# EAGLE design Mixer-Analog-OPA2134-Rev-G (EAGLE 8.3.1)
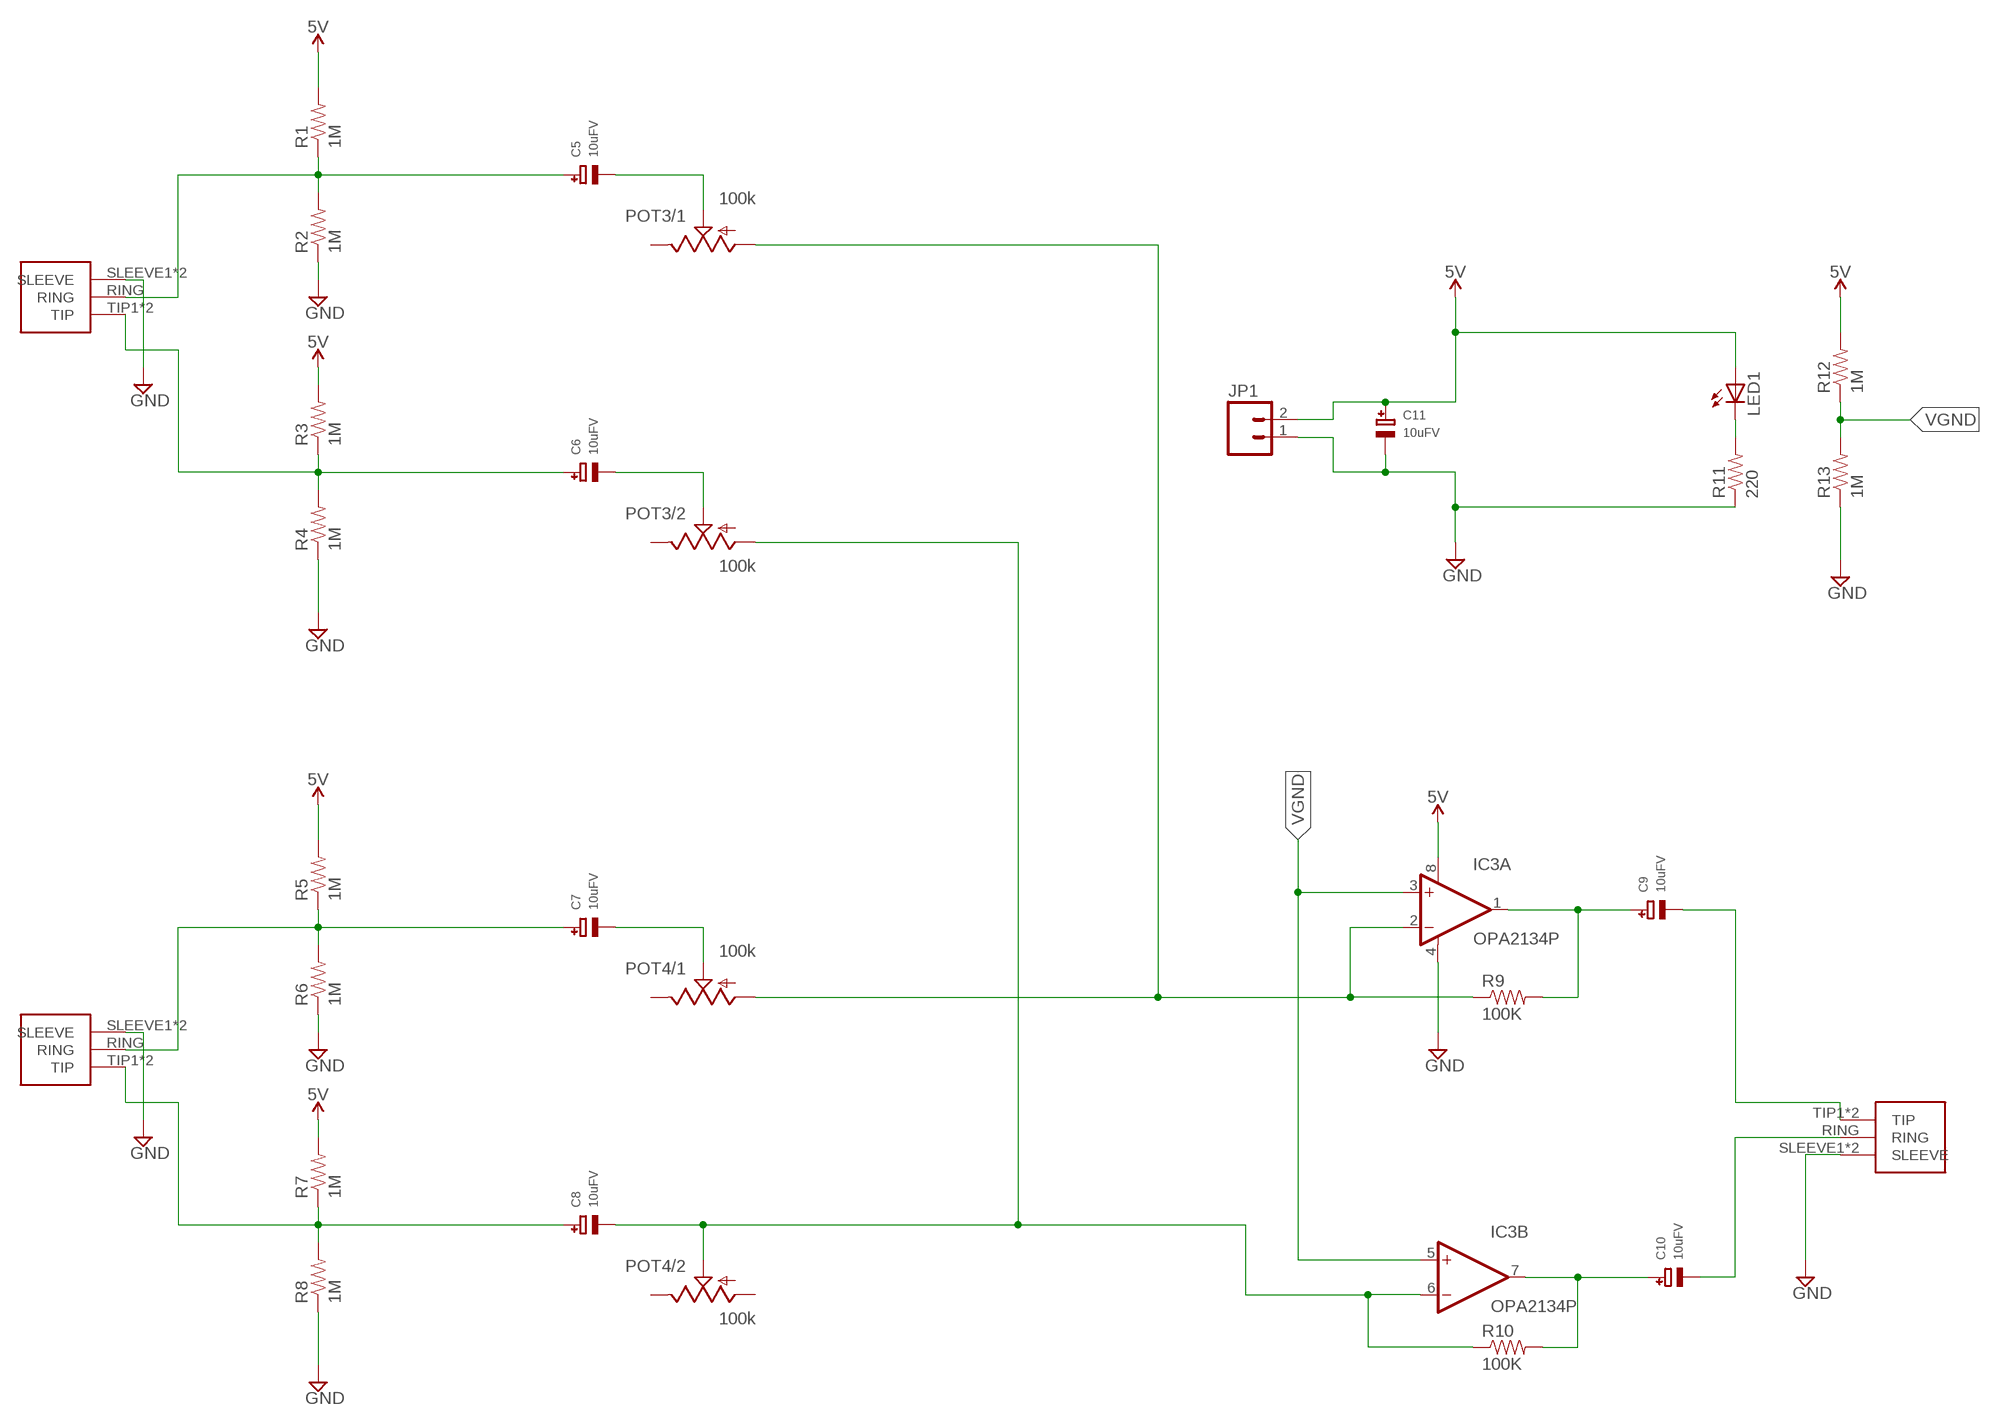
[diagram p0: schematic, sheet 1]

## Parts
C5  10uFV  CAP_ELECTROLYTICPTH_3.5MMGRID_8MMDIA  [CELEC_3.5MM_8MM]
C6  10uFV  CAP_ELECTROLYTICPTH_3.5MMGRID_8MMDIA  [CELEC_3.5MM_8MM]
C7  10uFV  CAP_ELECTROLYTICPTH_3.5MMGRID_8MMDIA  [CELEC_3.5MM_8MM]
C8  10uFV  CAP_ELECTROLYTICPTH_3.5MMGRID_8MMDIA  [CELEC_3.5MM_8MM]
C9  10uFV  CAP_ELECTROLYTICPTH_3.5MMGRID_8MMDIA  [CELEC_3.5MM_8MM]
C10  10uFV  CAP_ELECTROLYTICPTH_3.5MMGRID_8MMDIA  [CELEC_3.5MM_8MM]
C11  10uFV  CAP_ELECTROLYTICPTH_3.5MMGRID_8MMDIA  [CELEC_3.5MM_8MM]
IC3  OPA2134P  [DIL08]
J1  1/8"-F-STEREO-PCB  [1/8"-F-STEREO-PCB]
J2  1/8"-F-STEREO-PCB  [1/8"-F-STEREO-PCB]
J3  1/8"-F-STEREO-PCB  [1/8"-F-STEREO-PCB]
JP1  M02LOCK  [1X02_LOCK]
LED1  LED3MM  [LED3MM]
POT3  100k  POT-DUAL-PTV112-4420  [PTV112]
POT4  100k  POT-DUAL-PTV112-4420  [PTV112]
R1  1M  RESISTOREZ  [AXIAL-0.3EZ]
R2  1M  RESISTORAXIAL-0.3  [AXIAL-0.3]
R3  1M  RESISTOREZ  [AXIAL-0.3EZ]
R4  1M  RESISTOREZ  [AXIAL-0.3EZ]
R5  1M  RESISTOREZ  [AXIAL-0.3EZ]
R6  1M  RESISTOREZ  [AXIAL-0.3EZ]
R7  1M  RESISTOREZ  [AXIAL-0.3EZ]
R8  1M  RESISTOREZ  [AXIAL-0.3EZ]
R9  100K  RESISTOREZ  [AXIAL-0.3EZ]
R10  100K  RESISTOREZ  [AXIAL-0.3EZ]
R11  220  RESISTOREZ  [AXIAL-0.3EZ]
R12  1M  RESISTOREZ  [AXIAL-0.3EZ]
R13  1M  RESISTOREZ  [AXIAL-0.3EZ]

## Nets
5V: C11.+ IC3.8(A:V+) JP1.2 LED1.A R1.P$2 R3.P$2 R5.P$2 R7.P$2 R12.P$2
GND: C11.- IC3.4(A:V-) J1.SLEEVE1(SLEEVE) J1.SLEEVE2(SLEEVE) J2.SLEEVE1(SLEEVE) J2.SLEEVE2(SLEEVE) J3.SLEEVE1(SLEEVE) J3.SLEEVE2(SLEEVE) JP1.1 R2.P$1 R4.P$1 R6.P$1 R8.P$1 R11.P$1 R13.P$1
N$2: C5.- POT3.1.2(/1:S)
N$3: C6.+ J1.TIP1(TIP) J1.TIP2(TIP) R3.P$1 R4.P$2
N$5: C5.+ J1.RING R1.P$1 R2.P$2
N$6: C6.- POT3.2.2(/2:S)
N$7: C9.+ IC3.1(A:OUT) R9.P$2
N$10: C7.- POT4.1.2(/1:S)
N$13: C7.+ J2.RING R5.P$1 R6.P$2
N$14: C8.+ J2.TIP1(TIP) J2.TIP2(TIP) R7.P$1 R8.P$2
N$15: LED1.K(C) R11.P$2
N$17: C10.+ IC3.7(B:OUT) R10.P$2
N$61: C9.- J3.TIP1(TIP) J3.TIP2(TIP)
N$62: C10.- J3.RING
OUT-L: IC3.2(A:-IN) POT3.1.1(/1:A) POT4.1.1(/1:A) R9.P$1
OUT-R: C8.- IC3.6(B:-IN) POT3.2.1(/2:A) POT4.2.2(/2:S) R10.P$1
VGND: IC3.3(A:+IN) IC3.5(B:+IN) R12.P$1 R13.P$2
Unconnected: POT3.1.3(/1:E) POT3.2.3(/2:E) POT4.1.3(/1:E) POT4.2.1(/2:A) POT4.2.3(/2:E)

## Library data of the parts
C5-C11 = microbuilder:CAP_ELECTROLYTIC: Electrolytic Capacitors SMT PANASONIC_C - Size C Panasonic Electrolytic Aluminum Capacitor 47µF 16V 20% Electrolytic Capacitor [Digikey: PCE3890TR-ND] PANASONIC_D - Size D Panasonic Electrolytic Aluminum Capacitor 100µF 25V 20% Electrolytic Capacitor [Digikey: PCE3898TR-ND] PTH 3.5 mm grid, 8 mm diameter ... 3.5 mm grid, 10 mm diameter ...
IC3 = burr-brown:OPA2134: Operational Amplifier; MF: TEXAS INSTRUMENTS; MPN: OPA2134PA; OC_FARNELL: 1097574; OC_NEWARK: 74K3897
J1-J3 = CMU-ArtFab:1/8"-F-STEREO-PCB
JP1 = CMU-ArtFab:M02: Header 2 Standard 2-pin 0.1" header. Use with straight break away headers (SKU : PRT-00116), right angle break away headers (PRT-00553), swiss pins (PRT-00743), machine pins (PRT-00117), and female headers (PRT-00115). Molex polarized connector foot print use with SKU : PRT-08233 with associated crimp pins and housings.
LED1 = led:LED: LED OSRAM: - CHIPLED LG R971, LG N971, LY N971, LG Q971, LY Q971, LO R971, LY R971 LH N974, LH R974 LS Q976, LO Q976, LY Q976 LO Q996 - Hyper CHIPLED LW Q18S LB Q993, LB Q99A, LB R99A - SideLED LS A670, LO A670, LY A670, LG A670, LP A670 LB A673, LV A673, LT A673, LW A673 LH A674 LY A675 LS A676, LA A676, LO A676, LY A676, LW A676 LS A679, LY A679, LG A679 - Hyper Micro SIDELED® LS Y876, LA Y876, LO Y876, LY Y876 LT Y87S - SmartLED LW L88C, LW L88S LB L89C, LB L89S, LG L890 LS L89K, LO L89K, LY L89K LS L896, LA L896, LO L896, LY L896 - TOPLED LS T670, LO T670, LY T670, LG T670, LP T670 LSG T670, LSP T670, LSY T670, LOP T670, LYG T670 LG T671, LOG T671, LSG T671 LB T673, LV T673, LT T673, LW T673 LH T674 LS T676, LA T676, LO T676, LY T676, LB T676, LH T676, LSB T676, LW T676 LB T67C, LV T67C, LT T67C, LS T67K, LO T67K, LY T67K, LW E67C LS E67B, LA E67B, LO E67B, LY E67B, LB E67C, LV E67C, LT E67C LW T67C LS T679, LY T679, LG T679 LS T770, LO T770, LY T770, LG T770, LP T770 LB T773, LV T773, LT T773, LW T773 LH T774 LS E675, LA E675, LY E675, LS T675 LS T776, LA T776, LO T776, LY T776, LB T776 LHGB T686 LT T68C, LB T68C - Hyper Mini TOPLED® LB M676 - Mini TOPLED Santana® LG M470 LS M47K, LO M47K, LY M47K Source: http://www.osram.convergy.de LUXEON: - LUMILED® LXK2-PW12-R00, LXK2-PW12-S00, LXK2-PW14-U00, LXK2-PW14-V00 LXK2-PM12-R00, LXK2-PM12-S00, LXK2-PM14-U00 LXK2-PE12-Q00, LXK2-PE12-R00, LXK2-PE12-S00, LXK2-PE14-T00, LXK2-PE14-U00 LXK2-PB12-K00, LXK2-PB12-L00, LXK2-PB12-M00, LXK2-PB14-N00, LXK2-PB14-P00, LXK2-PB14-Q00 LXK2-PR12-L00, LXK2-PR12-M00, LXK2-PR14-Q00, LXK2-PR14-R00 LXK2-PD12-Q00, LXK2-PD12-R00, LXK2-PD12-S00 LXK2-PH12-R00, LXK2-PH12-S00 LXK2-PL12-P00, LXK2-PL12-Q00, LXK2-PL12-R00 Source: www.luxeon.com KINGBRIGHT: KA-3528ASYC Source: www.kingbright.com
POT3 POT4 = CMU-ArtFab:POT-DUAL-PTV112: Bourns 11mm dual potentiometer; AVAILABILITY: Unavailable; DESCRIPTION: Alt# Tce-10111410; MF: STMicroelectronics; MP: PTV112; PACKAGE: None; PRICE: None; SPICEPREFIX: J
R1-R10 = SparkFun-Passives:RESISTOR: Resistor Basic schematic elements and footprints for 0603, 1206, and PTH resistors.; SPICEPREFIX: R
R11-R13 = SparkFun-Passives:RESISTOR: Resistor Basic schematic elements and footprints for 0603, 1206, and PTH resistors.

## Board
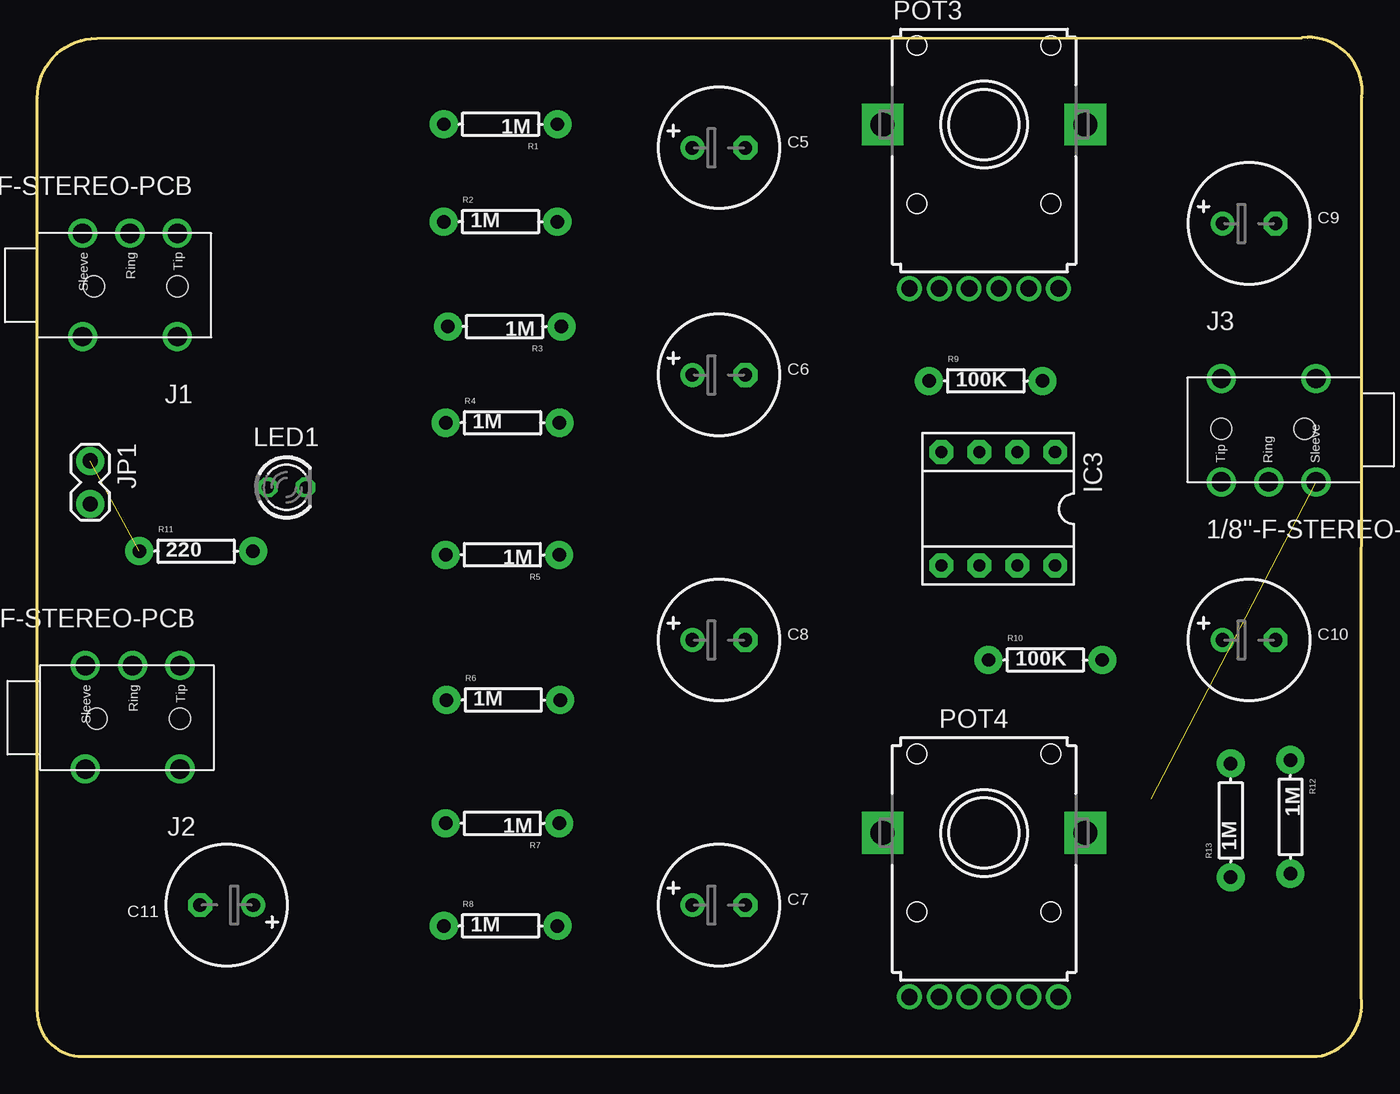
[diagram p1: board, top side]
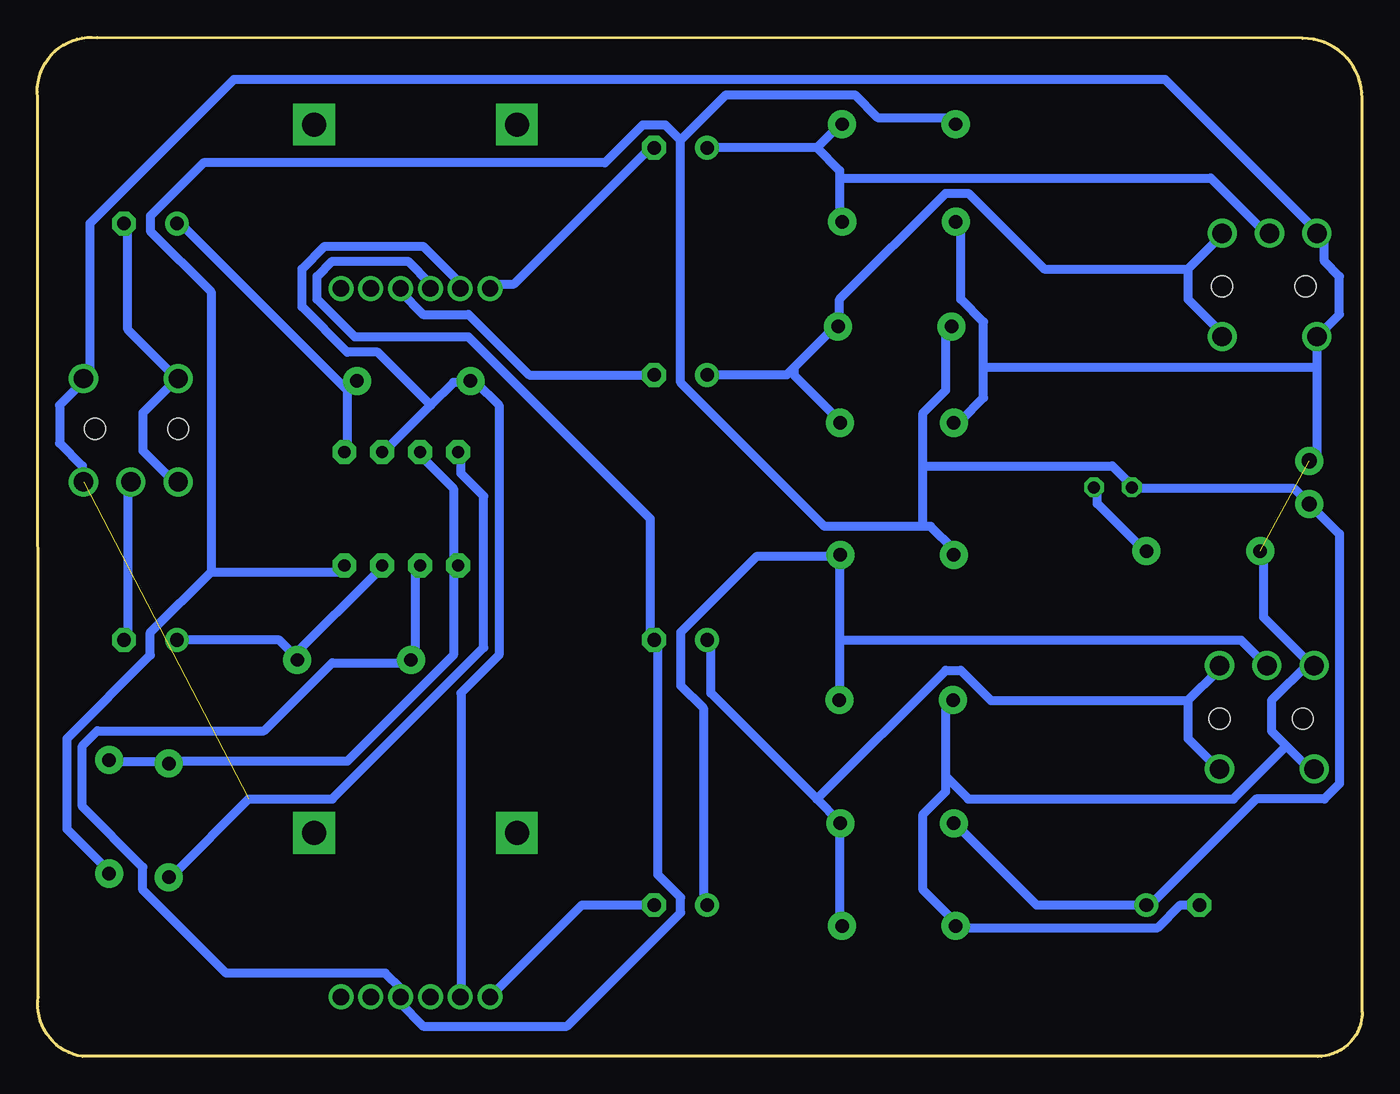
[diagram p2: board, bottom side, seen from below]

Size 88.87 x 68.37 mm. Coordinates in mm from the lower left corner, seen from the top.
Outline: 0,3 arc90 3,0 85.84,0 arc90 88.8,4 88.85,64.35 arc103 84.85,68.35 4,68.3 arc90 0,64.3 0,3
Copper layers (1*16): Top 0.035mm / dielectric 1.5mm / Bottom 0.035mm
Design rules "default *": minimum track width 24mil, minimum drill 0.35mm, track to track 16mil, track to pad 16mil, pad to pad 16mil, via to via 16mil, smd to smd 16mil, copper to edge 40mil, drill to drill 6mil, minimum pad ring 10mil, minimum via ring 8mil, stop-mask expansion 4mil, vias tented up to drill 0mil, thermal gap 10mil

### Footprints (pad centres in the part's own frame; a part is rotated, then mirrored left to right if it is on the bottom)
CELEC_3.5MM_8MM = drill 0.914 pad 1.6: + -1.778,0 | drill 0.914 pad 1.6 octagon: - 1.778,0
DIL08 = drill 0.813 pad 1.6 octagon: 1 -3.81,-3.81; 2 -1.27,-3.81; 3 1.27,-3.81; 4 3.81,-3.81; 5 3.81,3.81; 6 1.27,3.81; 7 -1.27,3.81; 8 -3.81,3.81
1/8"-F-STEREO-PCB = drill 1.3: RING 5.461,0; SLEEVE1 8.636,6.934; SLEEVE2 8.636,0; TIP1 2.286,6.934; TIP2 2.286,0 | hole 1.4: 2.286,3.556; 7.874,3.556
1X02_LOCK = drill 1.016 pad 1.88: 1 -0.178,0; 2 2.718,0
LED3MM = drill 0.813 octagon: A -1.27,0; K 1.27,0
PTV112 = drill 1.1 pad 1.676: 1.1 -3,-11; 1.2 -5,-11; 1.3 5,-11; 2.1 -1,-11; 2.2 1,-11; 2.3 3,-11 | drill 1.6 pad 2.8 square: M1 -6.8,0; M2 6.8,0
AXIAL-0.3EZ = drill 0.9 pad 1.88: P$1 -3.81,0; P$2 3.81,0
AXIAL-0.3 = drill 0.9 pad 1.88: P$1 -3.81,0; P$2 3.81,0

### Placement (x,y rotation side)
C5  45.72,60.96 0 top
C6  45.72,45.72 0 top
C7  45.72,10.16 0 top
C8  45.72,27.94 0 top
C9  81.28,55.88 0 top
C10  81.28,27.94 0 top
C11  12.7,10.16 180 top
IC3  64.46,36.74 180 top
J1  11.68,55.23 180 top
J2  11.86,26.22 180 top
J3  77.14,38.54 0 top
JP1  3.55,39.78 270 top
LED1  16.72,38.18 0 top
POT3  63.5,62.52 0 top
POT4  63.5,15 0 top
R1  31.08,62.54 180 top
R2  31.07,56 0 top
R3  31.35,48.97 180 top
R4  31.21,42.51 0 top
R5  31.2,33.65 180 top
R6  31.26,23.92 0 top
R7  31.2,15.65 180 top
R8  31.08,8.76 0 top
R9  63.62,45.32 0 top
R10  67.62,26.6 0 top
R11  10.66,33.9 0 top
R12  84.06,16.08 270 top
R13  80.05,15.84 90 top

### Tracks (layer width: path | path; a pad name or v marks a point on that pad's centre or on a via)
5V
  Bottom 0.61: 77.22,32.51 68.58,32.51 IC3.8 | 77.22,32.51 81.28,28.45 81.28,26.92 86.87,21.34 86.87,15.24 84.33,12.7 R12.P$2 | R7.P$2 26.92,15.24 21.84,10.16 C11.+ 14.22,10.16 7.11,17.27 2.54,17.27 1.52,18.29 1.52,35.05 3.05,36.58 JP1.2 3.56,37.08 4.57,38.1 15.24,38.1 LED1.A 15.75,38.61 16.76,39.62 29.46,39.62 | 45.72,61.47 42.67,64.52 34.04,64.52 32.51,62.99 27.43,62.99 R1.P$2 | 45.72,61.47 45.72,45.21 36.07,35.56 29.46,35.56 | 29.46,35.56 28.96,35.56 27.43,34.04 R5.P$2 | 29.46,35.56 29.46,39.62 | 29.46,39.62 29.46,43.18 27.94,44.7 27.94,48.77 R3.P$2 | 77.22,32.51 77.22,51.31 81.28,55.37 81.28,56.39 77.72,59.94 50.8,59.94 48.26,62.48 46.74,62.48 45.72,61.47
GND  (2 unrouted)
  Bottom 0.61: 3.56,26.42 6.6,29.46 6.6,33.53 R11.P$1 | 5.08,20.83 6.1,21.84 6.1,23.88 3.56,26.42 | 5.08,20.83 3.56,19.3 J2.SLEEVE1 | 3.56,26.42 J2.SLEEVE2 | C11.- 12.19,10.16 13.72,8.64 26.92,8.64 R8.P$1 27.43,9.14 29.46,11.18 29.46,16.26 27.94,17.78 27.94,18.8 | 27.94,18.8 27.94,23.88 R6.P$1 | 5.08,20.83 8.64,17.27 26.42,17.27 27.94,18.8 | 25.4,46.23 25.4,44.2 26.92,42.67 R4.P$1 | 25.4,46.23 25.4,49.28 26.92,50.8 26.92,55.88 R2.P$1 | J3.SLEEVE2 85.85,38.61 85.85,39.62 87.38,41.15 87.38,43.69 85.85,45.21 J3.SLEEVE1 85.34,45.72 85.34,55.88 75.69,65.53 13.21,65.53 3.05,55.37 J1.SLEEVE2 2.54,54.86 2.54,53.34 1.52,52.32 1.52,49.78 2.54,48.77 J1.SLEEVE1 3.05,48.26 3.05,46.23 | 3.05,46.23 3.05,40.13 JP1.1 | 3.05,46.23 25.4,46.23 | IC3.4 60.45,40.13 60.45,39.12 58.93,37.59 58.93,27.43 69.09,17.27 74.68,17.27 79.76,12.19 R13.P$1
N$2
  Bottom 0.61: C5.- 47.75,60.96 56.9,51.82 58.42,51.82 POT3.1.2
N$3
  Bottom 0.61: 11.68,52.83 11.68,50.8 9.65,48.77 J1.TIP1 | 11.68,52.83 9.65,54.86 J1.TIP2 | C6.+ 38.61,45.72 38.1,46.23 | 38.1,46.23 35.56,48.77 R3.P$1 35.05,49.28 35.05,50.8 27.94,57.91 26.42,57.91 21.34,52.83 11.68,52.83 | 38.1,46.23 38.1,45.72 35.05,42.67 R4.P$2
N$5
  Bottom 0.61: 36.58,60.96 C5.+ | 36.58,60.96 35.05,62.48 R1.P$1 | 35.05,58.93 35.05,59.44 36.58,60.96 | 35.05,58.93 35.05,56.39 R2.P$2 | 35.05,58.93 10.16,58.93 6.6,55.37 J1.RING
N$6
  Bottom 0.61: C6.- 55.88,45.72 59.94,49.78 62.99,49.78 64.52,51.31 POT3.2.2
N$7
  Bottom 0.61: 68.07,44.7 68.07,40.64 IC3.1 | 68.07,44.7 67.56,45.21 R9.P$2 68.07,44.7 | 68.07,44.7 79.25,55.88 C9.+
N$10
  Bottom 0.61: C7.- 52.32,10.16 58.42,4.06 POT4.1.2
N$13
  Bottom 0.61: 35.05,33.53 40.64,33.53 45.72,28.45 45.72,24.89 44.2,23.37 44.2,10.16 C7.+ | 35.05,33.53 35.05,27.94 | 35.05,27.94 35.05,24.38 R6.P$2 | 35.05,33.53 R5.P$1 | 35.05,27.94 8.13,27.94 6.6,26.42 J2.RING
N$14
  Bottom 0.61: 11.68,23.88 11.68,21.34 9.65,19.3 J2.TIP1 | 11.68,23.88 9.65,25.91 J2.TIP2 | 36.58,17.27 35.05,15.75 R7.P$1 35.05,15.24 35.05,9.14 R8.P$2 | 36.58,17.27 43.69,24.38 43.69,27.94 C8.+ | 11.68,23.88 24.89,23.88 26.92,25.91 27.94,25.91 36.58,17.27
N$15
  Bottom 0.61: LED1.K 17.78,38.1 17.78,37.08 14.73,34.04 R11.P$2
N$17
  Bottom 0.61: 71.63,26.92 66.04,32.51 IC3.7 | C10.+ 72.64,27.94 71.63,26.92 | 71.63,26.92 R10.P$2
N$61
  Bottom 0.61: C9.- 82.8,55.88 82.8,48.77 79.76,45.72 J3.TIP1 79.76,45.21 81.79,43.18 81.79,40.64 79.76,38.61 J3.TIP2
N$62
  Bottom 0.61: C10.- 82.8,27.94 82.8,38.1 J3.RING
OUT-L
  Bottom 0.61: 62.48,43.69 60.96,45.21 59.94,45.21 R9.P$1 59.44,45.21 57.91,43.69 57.91,26.92 60.45,24.38 60.45,4.06 POT4.1.1 | 62.48,43.69 65.53,40.64 IC3.2 | 62.48,43.69 66.04,47.24 68.07,47.24 71.12,50.29 71.12,52.83 69.6,54.36 62.99,54.36 60.45,51.82 POT3.1.1
OUT-R
  Bottom 0.61: IC3.6 63.5,32.51 63.5,26.92 R10.P$1 64.01,26.42 69.09,26.42 73.66,21.84 84.84,21.84 85.85,20.83 85.85,16.76 81.79,12.7 81.79,11.18 76.2,5.59 65.53,5.59 64.52,4.57 64.52,4.06 POT4.2.2 64.52,3.56 62.99,2.03 53.34,2.03 45.72,9.65 45.72,10.67 47.24,12.19 47.24,27.94 C8.- 47.75,27.94 47.75,36.07 59.94,48.26 67.56,48.26 70.1,50.8 70.1,52.32 69.09,53.34 64.01,53.34 62.48,51.82 POT3.2.1
VGND
  Bottom 0.61: R12.P$1 83.82,19.81 80.26,19.81 R13.P$2 79.76,19.81 68.07,19.81 60.96,26.92 60.96,32.51 IC3.5 60.96,33.02 60.96,38.1 62.99,40.13 IC3.3